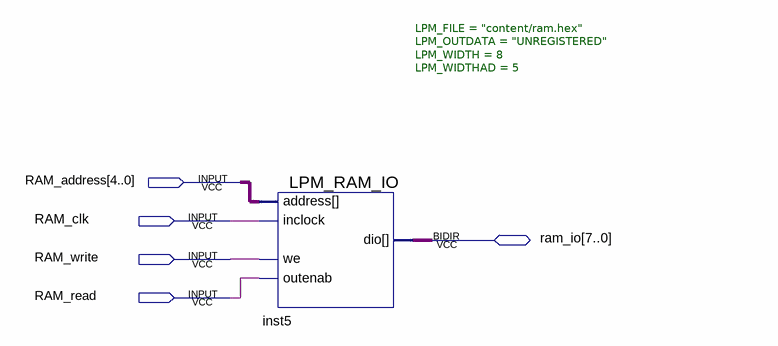
[diagram p0: schematic sheet]
// Quartus schematic RAM.bdf as structural Verilog: 1 symbols, 5 pins
module RAM (
  input  [4:0] RAM_address,
  input  RAM_clk,
  input  RAM_write,
  input  RAM_read,
  inout  [7:0] ram_io
);

  LPM_RAM_IO #(.LPM_FILE("content/ram.hex"), .LPM_OUTDATA("UNREGISTERED"), .LPM_WIDTH(8), .LPM_WIDTHAD(5)) inst5 (
    .address(RAM_address), .inclock(RAM_clk), .we(RAM_write), .outenab(RAM_read), .dio(ram_io));
endmodule
